# Altium schematic sheet STM32-PROX_6.SchDoc
size 261 x 179 mm
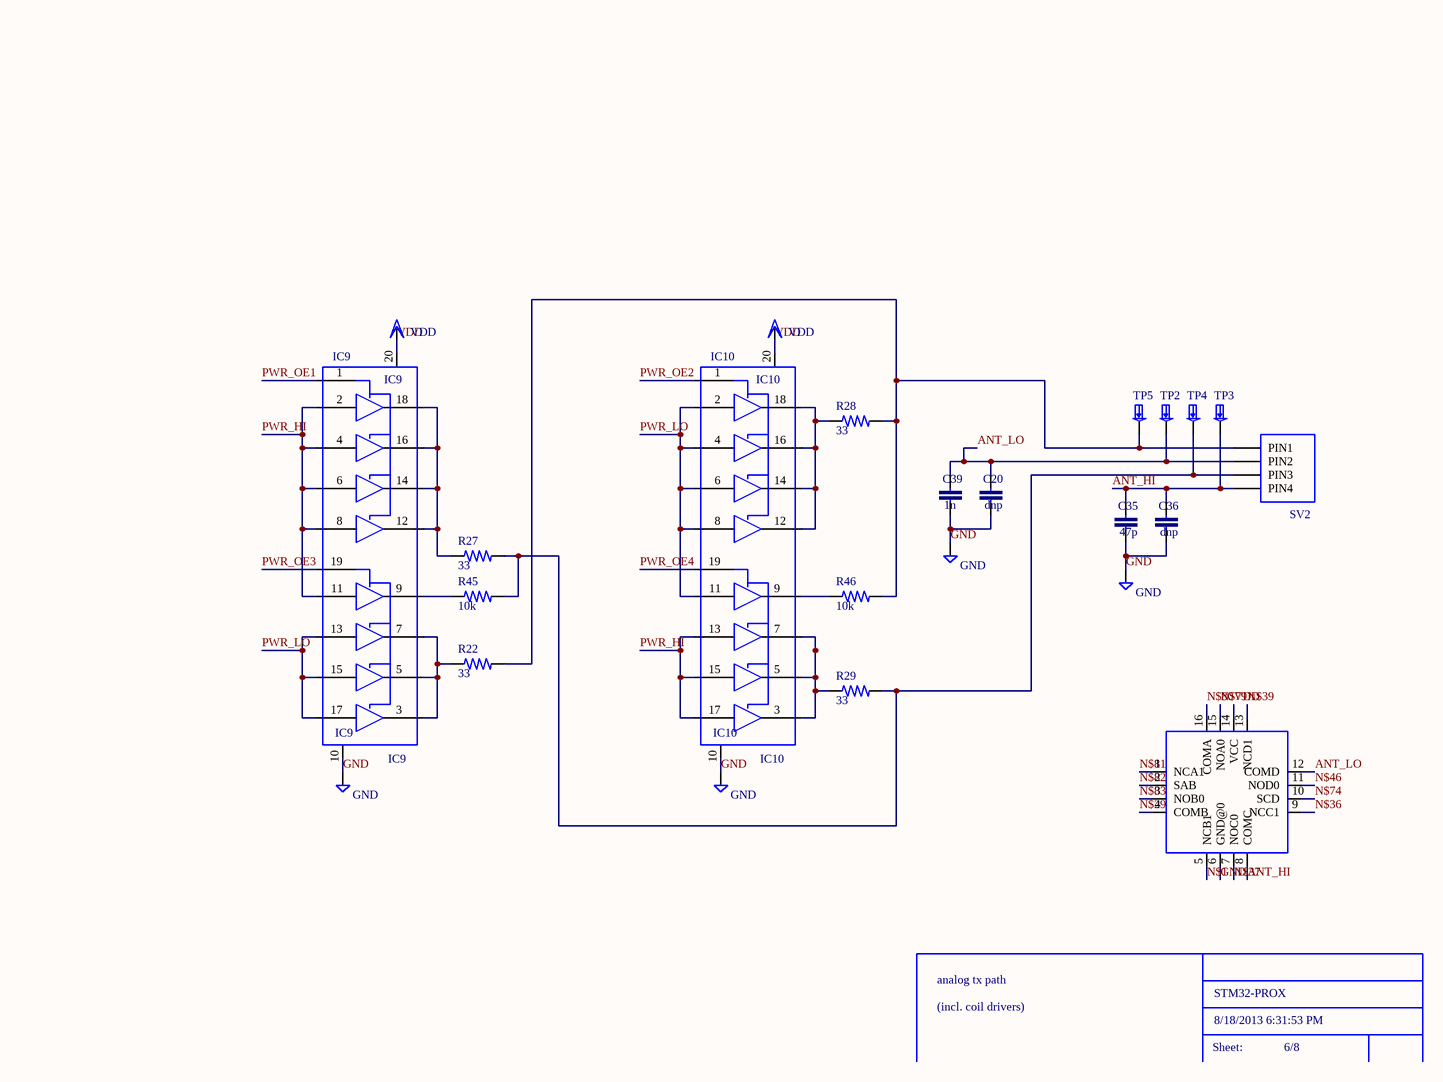
[diagram p0: STM32-PROX_6.SchDoc]

## Parts
C20  dnp  [RLC_0603]
C35  47p  [RLC_0603]
C36  dnp  [RLC_0603]
C39  1n  [RLC_0603]
FRAME5  (no value)
IC9  (no value)  [TSSOP-20]
IC10  (no value)  [TSSOP-20]
IC12  (no value)  [QFN16]
R22  33  [RLC_0603]
R27  33  [RLC_0603]
R28  33  [RLC_0603]
R29  33  [RLC_0603]
R45  10k  [RLC_0603]
R46  10k  [RLC_0603]
SV2  (no value)  [HIROSE-MQ172-4POS]
TP2  (no value)  [KEYSTONE-SMD-TESTPOINT-5015]
TP3  (no value)  [KEYSTONE-SMD-TESTPOINT-5015]
TP4  (no value)  [KEYSTONE-SMD-TESTPOINT-5015]
TP5  (no value)  [KEYSTONE-SMD-TESTPOINT-5015]
V26  GND
V27  GND
V41  GND
V47  GND
VDD5  VDD
VDD6  VDD

## Nets
ANT_HI: C35.1 C36.1 IC12.8(COMC) SV2.4(PIN4) TP3.1(P$1)
ANT_LO: C20.1 C39.1 IC12.12(COMD) SV2.2(PIN2) TP2.1(P$1)
GND: C20.2 C35.2 C36.2 C39.2 IC9.10(VSS) IC10.10(VSS) IC12.6(GND@0) V26.0(GND) V27.0(GND) V41.0(GND) V47.0(GND)
N$1: IC12.5(NCB1)
N$29: IC12.4(COMB)
N$36: IC12.9(NCC1)
N$37: IC12.7(NOC0)
N$39: IC12.13(NCD1)
N$46: IC12.11(NOD0)
N$74: IC12.10(SCD)
N$79: IC12.15(NOA0)
N$80: IC12.16(COMA)
N$81: IC12.1(NCA1)
N$82: IC12.2(SAB)
N$83: IC12.3(NOB0)
PWR_HI: IC9.2(1A1) IC9.4(1A2) IC9.6(1A3) IC9.8(1A4) IC9.11(2A1) IC10.13(2A2) IC10.15(2A3) IC10.17(2A4)
PWR_LO: IC9.13(2A2) IC9.15(2A3) IC9.17(2A4) IC10.2(1A1) IC10.4(1A2) IC10.6(1A3) IC10.8(1A4) IC10.11(2A1)
PWR_OE1: IC9.1(1NOE)
PWR_OE2: IC10.1(1NOE)
PWR_OE3: IC9.19(2NOE)
PWR_OE4: IC10.19(2NOE)
VDD: IC9.20(VDD) IC10.20(VDD) IC12.14(VCC) VDD5.0(VDD) VDD6.0(VDD)
NetIC9_3: IC9.3(2Y4) IC9.5(2Y3) IC9.7(2Y2) R22.1
NetIC9_9: IC9.9(2Y1) R45.1
NetIC9_12: IC9.12(1Y4) IC9.14(1Y3) IC9.16(1Y2) IC9.18(1Y1) R27.1
NetIC10_3: IC10.3(2Y4) IC10.5(2Y3) IC10.7(2Y2) R29.1
NetIC10_9: IC10.9(2Y1) R46.1
NetIC10_12: IC10.12(1Y4) IC10.14(1Y3) IC10.16(1Y2) IC10.18(1Y1) R28.1
NetR22_2: R22.2 R28.2 R46.2 SV2.1(PIN1) TP5.1(P$1)
NetR27_2: R27.2 R29.2 R45.2 SV2.3(PIN3) TP4.1(P$1)

## Notes on the sheet
- analog tx path
- (incl. coil drivers)
- (in symbol A4L-LOC) STM32-PROX; 8/18/2013 6:31:53 PM; Sheet:; 6/8

## Library data of the parts
C20 C35 C36 C39 = CAPACITORRLC_0603
FRAME5 = A4L-LOC
IC9 IC10 = 74XX244-OCTAL-TRISTATE-BUFFERS
IC12 = NLAST44599
R22 R27-R29 R45 R46 = RESISTORRLC_0603
SV2 = HIROSE-MQ172-4POS
TP2-TP5 = TESTPADKEYSTONE-SMD